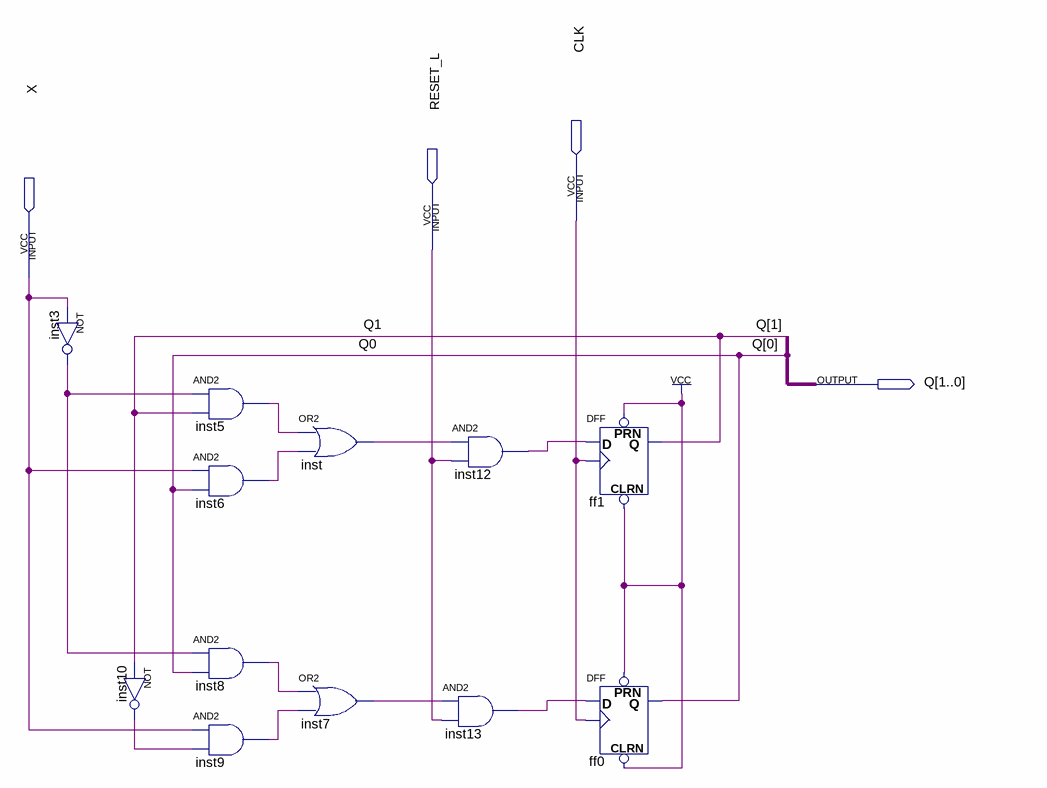
[diagram p0: schematic sheet]
// Quartus schematic enunciado2.bdf as structural Verilog: 12 symbols, 4 pins
module enunciado2 (
  input  CLK,
  input  RESET_L,
  input  X,
  output [1:0] Q
);

  wire inst3_out, inst5_out, inst6_out, inst7_out, inst8_out, inst9_out, inst10_out, inst12_out, inst13_out,
       inst_out;

  not inst3 (inst3_out, X);
  not inst10 (inst10_out, Q[1]);
  and inst5 (inst5_out, inst3_out, Q[1]);
  and inst6 (inst6_out, X, Q[0]);
  and inst8 (inst8_out, inst3_out, Q[0]);
  and inst9 (inst9_out, X, inst10_out);
  or inst (inst_out, inst5_out, inst6_out);
  or inst7 (inst7_out, inst8_out, inst9_out);
  and inst12 (inst12_out, inst_out, RESET_L);
  and inst13 (inst13_out, inst7_out, RESET_L);
  DFF ff1 (.CLRN(1'b1), .CLK(CLK), .D(inst12_out), .PRN(1'b1), .Q(Q[1]));
  DFF ff0 (.CLRN(1'b1), .CLK(CLK), .D(inst13_out), .PRN(1'b1), .Q(Q[0]));
endmodule
